# Altium schematic sheet Sheet1.SchDoc
size A4
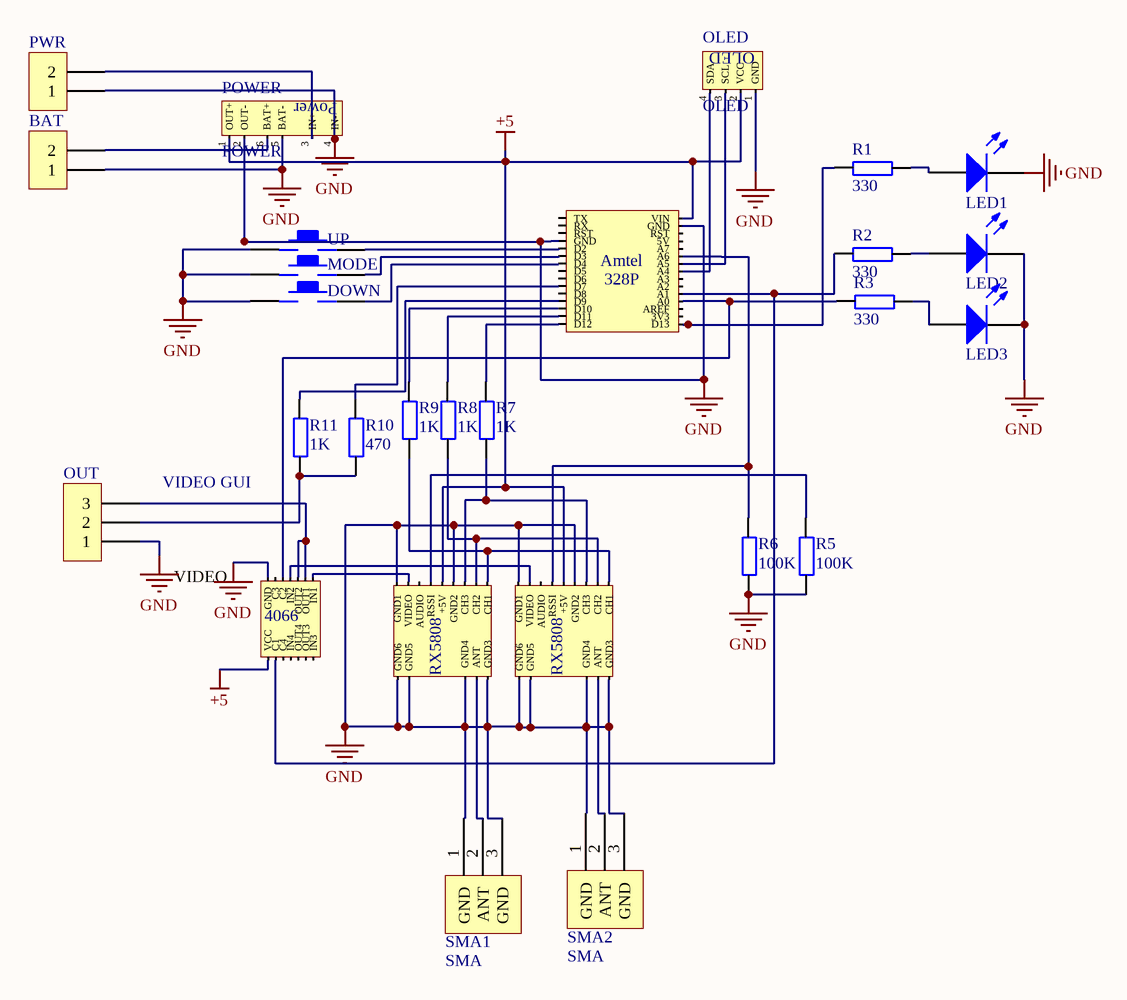
[diagram p0: Sheet1.SchDoc]

## Parts
AT328P  328P  [328]  (value not drawn)
BAT  CON2  [SIP2]  (value not drawn)
CD4066  CD4066  [4066]  (value not drawn)
DS1  LED1  [1206]
DS2  LED2  [1206]
DS3  LED3  [1206]
KEY1  UP  [KEY_M]
KEY2  MODE  [KEY_M]
KEY3  DOWN  [KEY_M]
OLED  OLED  [oled]
OUT  CON3  [SIP3]  (value not drawn)
POWER  POWER  [power]
PWR  CON1  [SIP2]  (value not drawn)
R1  330  [0805]
R2  330  [0805]
R3  330  [0805]
R5  100K  [0805]
R6  100K  [0805]
R7  1K  [0805]
R8  1K  [0805]
R9  1K  [0805]
R10  470  [0805]
R11  1K  [0805]
RX5808_1  RX5808  [rx5808]  (value not drawn)
RX5808_2  RX5808  [rx5808]  (value not drawn)
SMA1  SMA  [SMA]
SMA2  SMA  [SMA]

## Nets
+5: AT328P.30(VIN) CD4066.14(VCC) OLED.2(VCC) POWER.1(OUT+) RX5808_1.5(+5V) RX5808_2.5(+5V)
GND: AT328P.4(GND) AT328P.29(GND) BAT.1 CD4066.7(GND) DS1.2(K) DS2.2(K) DS3.2(K) KEY1.1 KEY2.1 KEY3.1 OLED.1(GND) OUT.1 POWER.2(OUT-) POWER.4(IN-) POWER.5(BAT-) PWR.1 R5.1 R6.1 RX5808_1.4(GND2) RX5808_1.9(GND1) RX5808_1.10(GND3) RX5808_1.12(GND4) RX5808_1.13(GND5) RX5808_1.14(GND6) RX5808_2.4(GND2) RX5808_2.9(GND1) RX5808_2.10(GND3) RX5808_2.12(GND4) RX5808_2.13(GND5) RX5808_2.14(GND6) SMA1.1(GND) SMA1.3(GND) SMA2.1(GND) SMA2.3(GND)
NetAT328P_5: AT328P.5(D2) KEY1.2
NetAT328P_6: AT328P.6(D3) KEY2.2
NetAT328P_7: AT328P.7(D4) KEY3.2
NetAT328P_10: AT328P.10(D7) R10.2
NetAT328P_12: AT328P.12(D9) R11.2
NetAT328P_13: AT328P.13(D10) R9.2
NetAT328P_14: AT328P.14(D11) R8.2
NetAT328P_15: AT328P.15(D12) R7.2
NetAT328P_16: AT328P.16(D13) R1.1
NetAT328P_19: AT328P.19(A0) CD4066.5(C2) R3.1
NetAT328P_20: AT328P.20(A1) CD4066.13(C1) R2.1
NetAT328P_23: AT328P.23(A4) OLED.4(SDA)
NetAT328P_24: AT328P.24(A5) OLED.3(SCL)
NetAT328P_25: AT328P.25(A6) R6.2 RX5808_2.6(RSSI)
NetBAT_2: BAT.2 POWER.6(BAT+)
NetCD4066_1: CD4066.1(IN1) RX5808_1.8(VIDEO)
NetCD4066_2: CD4066.2(OUT1) CD4066.3(OUT2) OUT.3
NetCD4066_4: CD4066.4(IN2) RX5808_2.8(VIDEO)
NetDS1_1: DS1.1(A) R1.2
NetDS2_1: DS2.1(A) R2.2
NetDS3_1: DS3.1(A) R3.2
NetOUT_2: OUT.2 R10.1 R11.1
NetPOWER_3: POWER.3(IN+) PWR.2
NetR5_2: R5.2 RX5808_1.6(RSSI)
NetR7_1: R7.1 RX5808_1.3(CH3) RX5808_2.3(CH3)
NetR8_1: R8.1 RX5808_1.2(CH2) RX5808_2.2(CH2)
NetR9_1: R9.1 RX5808_1.1(CH1) RX5808_2.1(CH1)
NetRX5808_1_11: RX5808_1.11(ANT) SMA1.2(ANT)
NetRX5808_2_11: RX5808_2.11(ANT) SMA2.2(ANT)

Not connected (* = marked no-connect by the designer): AT328P 1(TX) 2(RX) 3(RST) 8(D5) 9(D6) 11(D8) 17(3V3) 18(AREF) 21(A2) 22(A3) 26(A7) 27(5V) 28(RST); CD4066 6(C3) 8(IN3) 9(OUT3) 10(OUT4) 11(IN4) 12(C4); RX5808_1 7(AUDIO); RX5808_2 7(AUDIO)

## Notes on the sheet
- VIDEO GUI
- VIDEO
- (in symbol 328P) Amtel
- (in symbol CD4066) 4066
- (in symbol POWER) Power

## Library data of the parts
DS1-DS3 = LED2: Typical RED, GREEN, YELLOW, AMBER GaAs LED; Published: 8-Jun-2000; LatestRevisionDate: 17-Jul-2002; LatestRevisionNote: Re-released for DXP Platform.; PackageDocument: Feb-2002; PackageReference: 3.2X1.6X1.1; Publisher: Altium Limited
KEY1-KEY3 = KEY_M
PWR = CON2
R1-R3 R5-R11 = R
SMA1 SMA2 = Component_1